# EAGLE design RATT_REV1 (EAGLE 7.7.0)
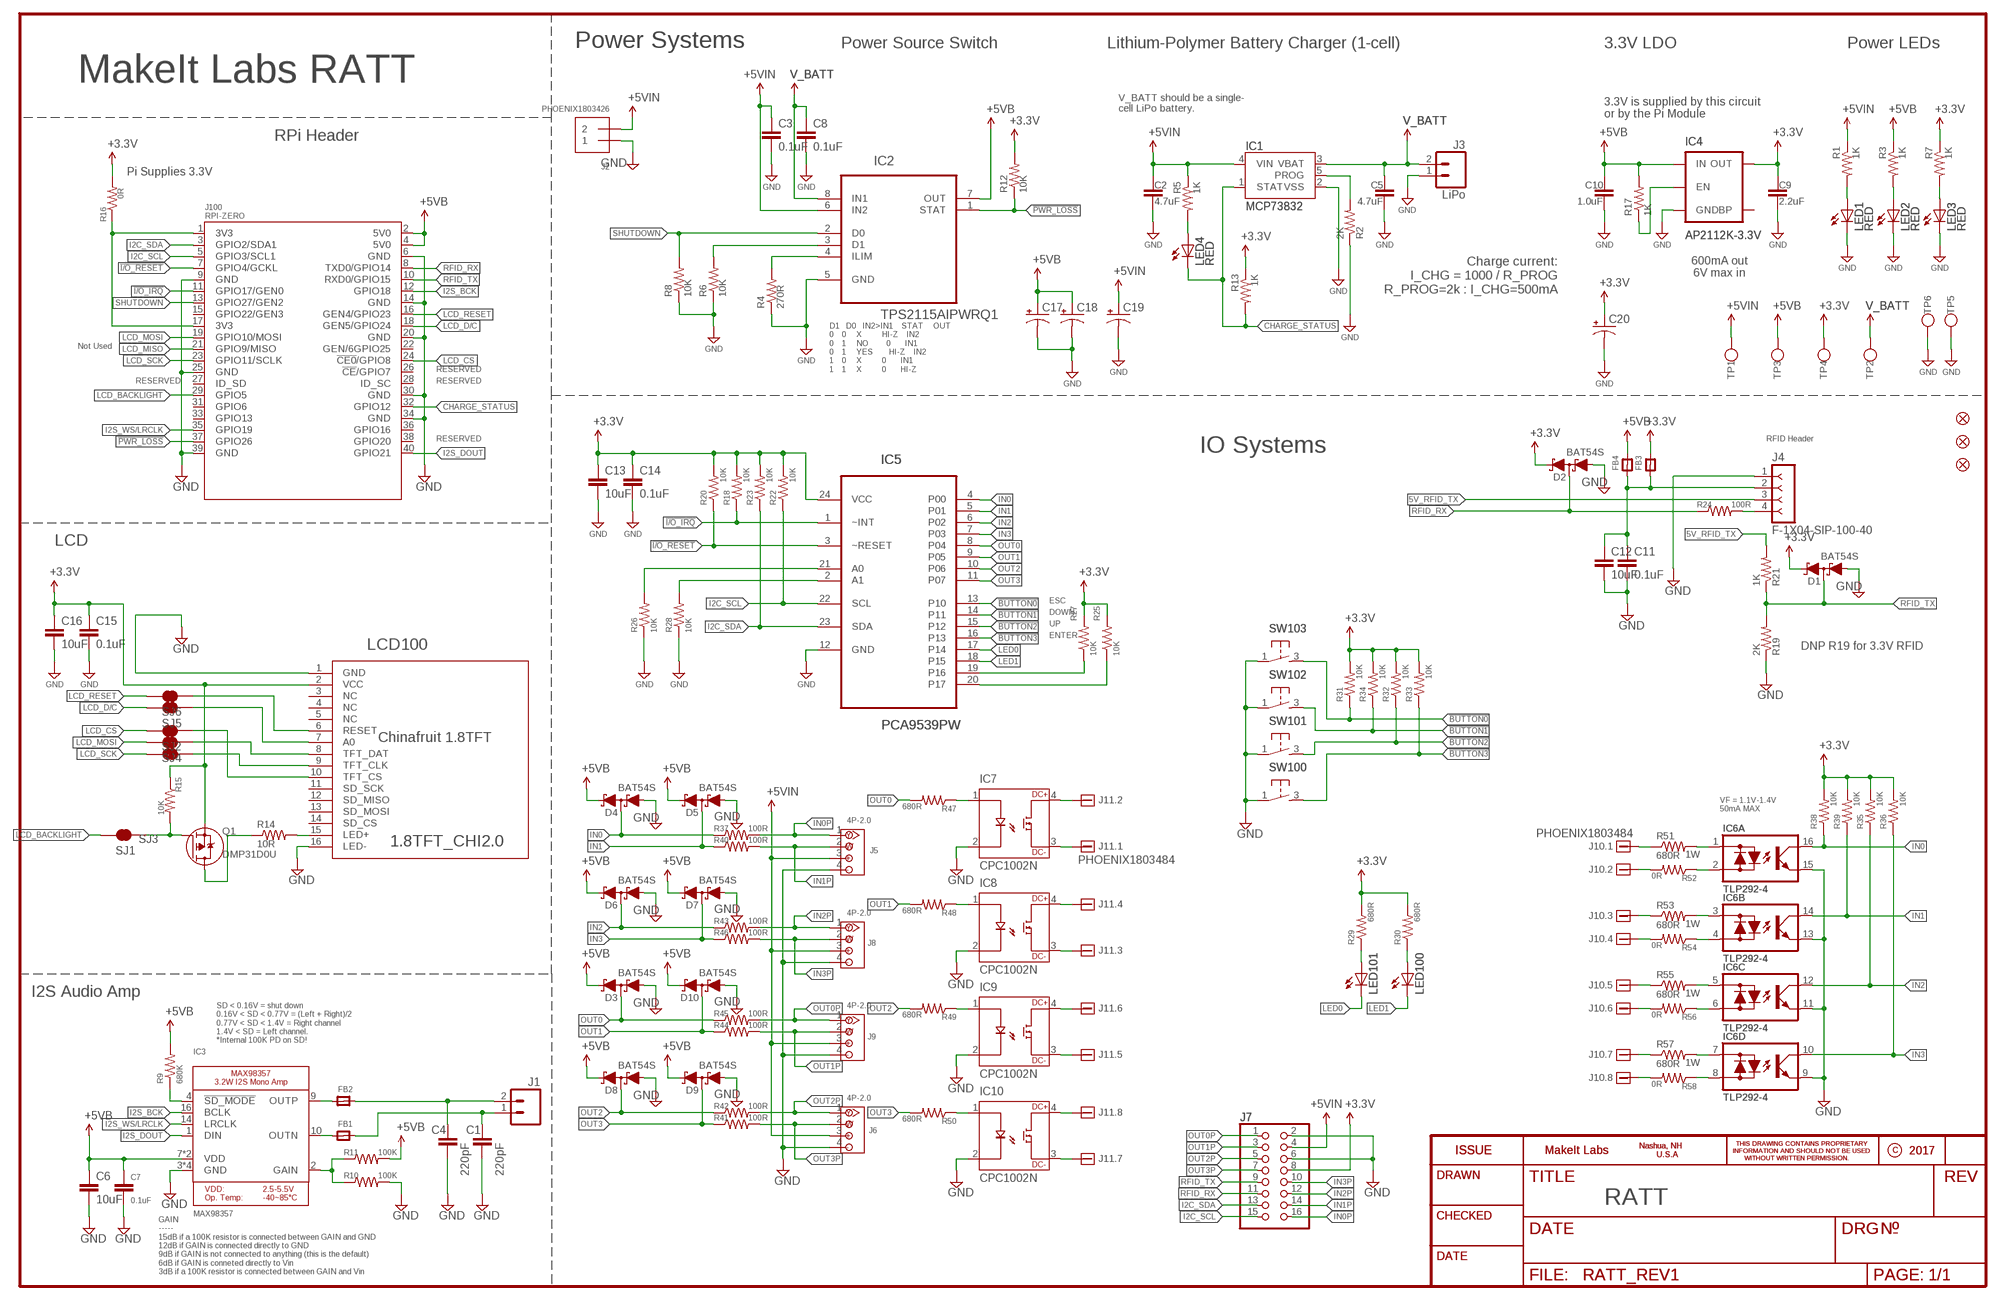
[diagram p0: schematic, sheet 1]

## Parts
C1  220pF  CAP0603  [0603-CAP]
C2  4.7uF  CAP0603  [0603-CAP]
C3  0.1uF  CAP0603  [0603-CAP]
C4  220pF  CAP0603  [0603-CAP]
C5  4.7uF  CAP0603  [0603-CAP]
C6  10uF  CAP0805  [0805-CAP]
C7  0.1uF  CAP0603  [0603-CAP]
C8  0.1uF  CAP0603  [0603-CAP]
C9  2.2uF  CAP0603  [0603-CAP]
C10  1.0uF  CAP0603  [0603-CAP]
C11  0.1uF  CAP0603  [0603-CAP]
C12  10uF  CAP0805  [0805-CAP]
C13  10uF  CAP0805  [0805-CAP]
C14  0.1uF  CAP0603  [0603-CAP]
C15  0.1uF  CAP0603  [0603-CAP]
C16  10uF  CAP0805  [0805-CAP]
C17  CPOL-USD  [PANASONIC_D]
C18  CPOL-USD  [PANASONIC_D]
C19  CPOL-USD  [PANASONIC_D]
C20  CPOL-USD  [PANASONIC_D]
D1  BAT54S  [SOT-23]
D2  BAT54S  [SOT-23]
D3  BAT54S  [SOT-23]
D4  BAT54S  [SOT-23]
D5  BAT54S  [SOT-23]
D6  BAT54S  [SOT-23]
D7  BAT54S  [SOT-23]
D8  BAT54S  [SOT-23]
D9  BAT54S  [SOT-23]
D10  BAT54S  [SOT-23]
FB1  FERRITE  [0603]
FB2  FERRITE  [0603]
FB3  FERRITE  [0603]
FB4  FERRITE  [0603]
FID1  FIDUCIAL40MILX80MIL  [FIDUCIAL-40MILX80MIL]
FID2  FIDUCIAL40MILX80MIL  [FIDUCIAL-40MILX80MIL]
FID3  FIDUCIAL40MILX80MIL  [FIDUCIAL-40MILX80MIL]
IC1  MCP73832  MCP73831  [SOT23-5]
IC2  TPS2115AIPWRQ1  [SOP65P640X120-8N]
IC3  MAX98357  AUDIOAMP_MAX98357  [QFN16_3MM]
IC4  AP2112K-3.3V  V_REG_LDOSMD  [SOT23-5]
IC5  PCA9539PW  [SOP65P640X120-24N]
IC6  TLP292-4  [SO-16]
IC7  CPC1002N  [CPC1002N]
IC8  CPC1002N  [CPC1002N]
IC9  CPC1002N  [CPC1002N]
IC10  CPC1002N  [CPC1002N]
J1  M02POLAR  [MOLEX-1X2]
J2  PHOENIX1803426  [1803426]
J3  LiPo  M02JST-PTH-2  [JST-2-PTH]
J4  F-1X04-SIP-100-40  [SIP-100-04-40]
J5  4P-2.0  GROVE-CONNECTOR-TH-VERT  [HW4-2.0]
J6  4P-2.0  GROVE-CONNECTOR-TH-VERT  [HW4-2.0]
J7  PINHD-2X8SHROUD  [2X08_SHROUD]
J8  4P-2.0  GROVE-CONNECTOR-TH-VERT  [HW4-2.0]
J9  4P-2.0  GROVE-CONNECTOR-TH-VERT  [HW4-2.0]
J10  PHOENIX1803484  [1803484]
J11  PHOENIX1803484  [1803484]
J100  RPI-ZERO  [RASPBERRYPI_BASTELSTUBE_V13_RASPI_BOARD_B+_FULL]
LCD100  1.8TFT_CHI2.0  [1.8TFT_CHI_2.0]
LED1  RED  LED-RED0603  [LED-0603]
LED2  RED  LED-RED0603  [LED-0603]
LED3  RED  LED-RED0603  [LED-0603]
LED4  RED  LED-RED0603  [LED-0603]
LED100  LED5MM  [LED5MM]
LED101  LED5MM  [LED5MM]
Q1  DMP31D0U  [SOT23]
R1  1K  RESISTOR0603  [0603-RES]
R2  2K  RESISTOR0603  [0603-RES]
R3  1K  RESISTOR0603  [0603-RES]
R4  270R  RESISTOR0603  [0603-RES]
R5  1K  RESISTOR0603  [0603-RES]
R6  10K  RESISTOR0603  [0603-RES]
R7  1K  RESISTOR0603  [0603-RES]
R8  10K  RESISTOR0603  [0603-RES]
R9  680K  RESISTOR0603  [0603-RES]
R10  100K  RESISTOR0603  [0603-RES]
R11  100K  RESISTOR0603  [0603-RES]
R12  10K  RESISTOR0603  [0603-RES]
R13  1K  RESISTOR0603  [0603-RES]
R14  10R  RESISTOR1206  [1206-RES]
R15  10K  RESISTOR0603  [0603-RES]
R16  0R  RESISTOR0603  [0603-RES]
R17  1K  RESISTOR0603  [0603-RES]
R18  10K  RESISTOR0603  [0603-RES]
R19  2K  RESISTOR0603  [0603-RES]
R20  10K  RESISTOR0603  [0603-RES]
R21  1K  RESISTOR0603  [0603-RES]
R22  10K  RESISTOR0603  [0603-RES]
R23  10K  RESISTOR0603  [0603-RES]
R24  100R  RESISTOR0603  [0603-RES]
R25  10K  RESISTOR0603  [0603-RES]
R26  10K  RESISTOR0603  [0603-RES]
R27  10K  RESISTOR0603  [0603-RES]
R28  10K  RESISTOR0603  [0603-RES]
R29  680R  RESISTOR0603  [0603-RES]
R30  680R  RESISTOR0603  [0603-RES]
R31  10K  RESISTOR0603  [0603-RES]
R32  10K  RESISTOR0603  [0603-RES]
R33  10K  RESISTOR0603  [0603-RES]
R34  10K  RESISTOR0603  [0603-RES]
R35  10K  RESISTOR0603  [0603-RES]
R36  10K  RESISTOR0603  [0603-RES]
R37  100R  RESISTOR0603  [0603-RES]
R38  10K  RESISTOR0603  [0603-RES]
R39  10K  RESISTOR0603  [0603-RES]
R40  100R  RESISTOR0603  [0603-RES]
R41  100R  RESISTOR0603  [0603-RES]
R42  100R  RESISTOR0603  [0603-RES]
R43  100R  RESISTOR0603  [0603-RES]
R44  100R  RESISTOR0603  [0603-RES]
R45  100R  RESISTOR0603  [0603-RES]
R46  100R  RESISTOR0603  [0603-RES]
R47  680R  RESISTOR0603  [0603-RES]
R48  680R  RESISTOR0603  [0603-RES]
R49  680R  RESISTOR0603  [0603-RES]
R50  680R  RESISTOR0603  [0603-RES]
R51  680R  RESISTOR2512  [2512-RES]
R52  0R  RESISTOR0603  [0603-RES]
R53  680R  RESISTOR2512  [2512-RES]
R54  0R  RESISTOR0603  [0603-RES]
R55  680R  RESISTOR2512  [2512-RES]
R56  0R  RESISTOR0603  [0603-RES]
R57  680R  RESISTOR2512  [2512-RES]
R58  0R  RESISTOR0603  [0603-RES]
SJ1  JUMPER-PAD-2-NC_BY_TRACE  SOLDERJUMPER_CLOSED10MIL  [SOLDERJUMPER_10MIL]
SJ2  JUMPER-PAD-2-NC_BY_TRACE  SOLDERJUMPER_CLOSED10MIL  [SOLDERJUMPER_10MIL]
SJ3  JUMPER-PAD-2-NC_BY_TRACE  SOLDERJUMPER_CLOSED10MIL  [SOLDERJUMPER_10MIL]
SJ4  JUMPER-PAD-2-NC_BY_TRACE  SOLDERJUMPER_CLOSED10MIL  [SOLDERJUMPER_10MIL]
SJ5  JUMPER-PAD-2-NC_BY_TRACE  SOLDERJUMPER_CLOSED10MIL  [SOLDERJUMPER_10MIL]
SJ6  JUMPER-PAD-2-NC_BY_TRACE  SOLDERJUMPER_CLOSED10MIL  [SOLDERJUMPER_10MIL]
SW100  ESWITCH_320  [ESWITCH320]
SW101  ESWITCH_320  [ESWITCH320]
SW102  ESWITCH_320  [ESWITCH320]
SW103  ESWITCH_320  [ESWITCH320]
TP1  5VIN  RCW-0C  [1206-RCW]
TP2  BATT  RCW-0C  [1206-RCW]
TP3  5VB  RCW-0C  [1206-RCW]
TP4  3.3V  RCW-0C  [1206-RCW]
TP5  GND  RCW-0C  [1206-RCW]
TP6  GND  RCW-0C  [1206-RCW]

## Nets
3V3: J100.1(3V3) J100.17(3V3) R16.1
5V_RFID_TX: J4.3 R21.2
!BUTTON0: IC5.13(P10) R31.1 SW103.3
!BUTTON1: IC5.14(P11) R34.1 SW102.3
!BUTTON2: IC5.15(P12) R32.1 SW101.3
!BUTTON3: IC5.16(P13) R33.1 SW100.3
!I/O_IRQ: IC5.1(~INT) J100.11(GPIO17/GEN0) R18.1
!I/O_RESET: IC5.3(~RESET) J100.7(GPIO4/GCKL) R20.1
!PWR_LOSS: IC2.1(STAT) J100.37(GPIO26) R12.1
+3.3V: C9.1 C13.1 C14.1 C15.1 C16.1 C20.+ D1.2(C2) D2.2(C2) FB3.2 IC4.5(OUT) IC5.24(VCC) J7.8 LCD100.2(VCC) Q1.2(S) R7.1 R12.2 R13.1 R15.1 R16.2 R18.2 R20.2 R22.2 R23.2 R25.2 R27.2 R29.2 R30.2 R31.2 R32.2 R33.2 R34.2 R35.2 R36.2 R38.2 R39.2 TP4.1(TP)
+5VB: C6.1 C7.1 C10.1 C17.+ C18.+ D3.2(C2) D4.2(C2) D5.2(C2) D6.2(C2) D7.2(C2) D8.2(C2) D9.2(C2) D10.2(C2) FB4.2 IC2.7(OUT) IC3.7(VDD) IC3.8(VDD) IC4.1(IN) J100.2(5V0) J100.4(5V0) R3.1 R9.2 R11.2 R17.2 TP3.1(TP)
+5VIN: C2.1 C3.1 C19.+ IC1.4(VIN) IC2.6(IN2) J2.2 J5.3 J6.3 J7.4 J8.3 J9.3 R1.1 R5.1 TP1.1(TP)
CHARGE_STATUS: IC1.1(STAT) J100.32(GPIO12) LED4.C R13.2
GND: C1.2 C2.2 C3.2 C4.2 C5.2 C6.2 C7.2 C8.2 C9.2 C10.2 C11.2 C12.2 C13.2 C14.2 C15.2 C16.2 C17.- C18.- C19.- C20.- D1.1(A1) D2.1(A1) D3.1(A1) D4.1(A1) D5.1(A1) D6.1(A1) D7.1(A1) D8.1(A1) D9.1(A1) D10.1(A1) IC1.2(VSS) IC2.5(GND) IC3.3(GND) IC3.11(GND) IC3.15(GND) IC3.THERMAL(GND) IC4.2(GND) IC5.12(GND) IC6.9(D:E) IC6.11(C:E) IC6.13(B:E) IC6.15(A:E) IC7.2(CATHODE) IC8.2(CATHODE) IC9.2(CATHODE) IC10.2(CATHODE) J2.1 J3.1 J4.1 J5.4 J6.4 J7.2 J7.6 J8.4 J9.4 J100.6(GND) J100.9(GND) J100.14(GND) J100.20(GND) J100.25(GND) J100.30(GND) J100.34(GND) J100.39(GND) LCD100.1(GND) LCD100.16(LED-) LED1.C LED2.C LED3.C R2.1 R4.1 R6.1 R8.1 R10.2 R19.1 R26.1 R28.1 SW100.1 SW101.1 SW102.1 SW103.1 TP5.1(TP) TP6.1(TP)
I2C_SCL: IC5.22(SCL) J7.15 J100.5(GPIO3/SCL1) R22.1
I2C_SDA: IC5.23(SDA) J7.13 J100.3(GPIO2/SDA1) R23.1
I2S_BCK: IC3.16(BCLK) J100.12(GPIO18)
I2S_DOUT: IC3.1(DIN) J100.40(GPIO21)
I2S_WS/LRCLK: IC3.14(LRCLK) J100.35(GPIO19)
IN0: D4.3(C1A2) IC5.4(P00) IC6.16(A:C) R37.1 R38.1
IN0P: J5.1 J7.16 R37.2
IN1: D5.3(C1A2) IC5.5(P01) IC6.14(B:C) R39.1 R40.1
IN1P: J5.2 J7.14 R40.2
IN2: D6.3(C1A2) IC5.6(P02) IC6.12(C:C) R35.1 R43.1
IN2P: J7.12 J8.1 R43.2
IN3: D7.3(C1A2) IC5.7(P03) IC6.10(D:C) R36.1 R46.1
IN3P: J7.10 J8.2 R46.2
LCD_BACKLIGHT: J100.29(GPIO5) SJ1.2
LCD_CS: J100.24(!CE0!/GPIO8) SJ2.2
LCD_D/C: J100.18(GEN5/GPIO24) SJ5.2
LCD_MISO: J100.21(GPIO9/MISO)
LCD_MOSI: J100.19(GPIO10/MOSI) SJ4.2
LCD_RESET: J100.16(GEN4/GPIO23) SJ6.2
LCD_SCK: J100.23(GPIO11/SCLK) SJ3.2
LED0: IC5.17(P14) LED101.K(C)
LED1: IC5.18(P15) LED100.K(C)
N$1: IC3.2(GAIN) R10.1 R11.1
N$2: FB2.1 IC3.9(OUTP)
N$3: Q1.3(D) R14.1
N$4: FB1.1 IC3.10(OUTN)
N$5: IC3.4(!SD_MODE) R9.1
N$6: C1.1 FB1.2 J1.1
N$7: C4.1 FB2.2 J1.2
N$8: IC5.20(P17) R25.1
N$9: LCD100.15(LED+) R14.2
N$10: J4.4 R24.2
N$11: LED3.A R7.2
N$12: LED2.A R3.2
N$13: IC5.19(P16) R27.1
N$14: IC1.5(PROG) R2.2
N$15: IC6.2(A:AC2) R52.1
N$17: LED4.A R5.2
N$18: IC4.3(EN) R17.1
N$19: IC6.1(A:AC1) R51.2
N$20: IC6.8(D:AC2) R58.1
N$21: IC5.21(A0) R26.2
N$22: IC5.2(A1) R28.2
N$23: IC6.7(D:AC1) R57.2
N$24: IC6.6(C:AC2) R56.1
N$25: IC6.5(C:AC1) R55.2
N$26: IC2.3(D1) R6.2
N$27: LCD100.6(RESET) SJ6.1
N$28: LCD100.7(A0) SJ5.1
N$29: LCD100.10(TFT_CS) SJ2.1
N$30: LCD100.8(TFT_DAT) SJ4.1
N$31: LCD100.9(TFT_CLK) SJ3.1
N$32: IC7.3(DC-) J11.1
N$33: Q1.1(G) R15.2 SJ1.1
N$36: IC6.4(B:AC2) R54.1
N$37: IC2.4(ILIM) R4.2
N$39: IC6.3(B:AC1) R53.2
N$40: J10.4 R54.2
N$41: J10.3 R53.1
N$42: J10.2 R52.2
N$43: J10.1 R51.1
N$44: J10.5 R55.1
N$45: J10.6 R56.2
N$46: J10.7 R57.1
N$47: J10.8 R58.2
N$48: LED101.A R29.1
N$49: LED100.A R30.1
N$50: LED1.A R1.2
N$51: C11.1 C12.1 FB3.1 FB4.1 J4.2
N$58: IC7.1(ANODE) R47.1
N$59: IC7.4(DC+) J11.2
N$60: IC10.3(DC-) J11.7
N$61: IC8.1(ANODE) R48.1
N$62: IC10.4(DC+) J11.8
N$63: IC9.3(DC-) J11.5
N$64: IC9.4(DC+) J11.6
N$65: IC8.3(DC-) J11.3
N$66: IC8.4(DC+) J11.4
N$68: IC9.1(ANODE) R49.1
N$69: IC10.1(ANODE) R50.1
OUT0: D3.3(C1A2) IC5.8(P04) R45.1 R47.2
OUT0P: J7.1 J9.1 R45.2
OUT1: D10.3(C1A2) IC5.9(P05) R44.1 R48.2
OUT1P: J7.3 J9.2 R44.2
OUT2: D8.3(C1A2) IC5.10(P06) R42.1 R49.2
OUT2P: J6.1 J7.5 R42.2
OUT3: D9.3(C1A2) IC5.11(P07) R41.1 R50.2
OUT3P: J6.2 J7.7 R41.2
RFID_RX: D2.3(C1A2) J7.11 J100.8(TXD0/GPIO14) R24.1
RFID_TX: D1.3(C1A2) J7.9 J100.10(RXD0/GPIO15) R19.2 R21.1
SHUTDOWN: IC2.2(D0) J100.13(GPIO27/GEN2) R8.2
V_BATT: C5.1 C8.1 IC1.3(VBAT) IC2.8(IN1) J3.2 TP2.1(TP)
Unconnected: IC4.4(BP) J100.15(GPIO22/GEN3) J100.22(GEN/6GPIO25) J100.26(!CE!/GPIO7) J100.27(ID_SD) J100.28(ID_SC) J100.31(GPIO6) J100.33(GPIO13) J100.36(GPIO16) J100.38(GPIO20) LCD100.3(NC) LCD100.4(NC) LCD100.5(NC) LCD100.11(SD_SCK) LCD100.12(SD_MISO) LCD100.13(SD_MOSI) LCD100.14(SD_CS)

## Notes on the sheet
- Power Systems | Power Source Switch | Lithium-Polymer Battery Charger (1-cell) | 3.3V LDO | Power LEDs
- MakeIt Labs RATT
- V_BATT should be a single-
  cell LiPo battery.
- 3.3V is supplied by this circuit
  or by the Pi Module
- RPi Header
- Pi Supplies 3.3V
- Charge current:
  I_CHG = 1000 / R_PROG
  R_PROG=2k : I_CHG=500mA
- 600mA out
  6V max in
- Not Used
- RESERVED
- D1   D0   IN2>IN1    STAT     OUT
  0    0     X          HI-Z    IN2
  0    1     NO         0       IN1
  0    1     YES        HI-Z    IN2
  1    0     X          0       IN1
  1    1     X          0       HI-Z
- RESERVED | RESERVED
- RESERVED | RFID Header
- IO Systems
- LCD
- ESC
- DOWN
- UP
- ENTER
- DNP R19 for 3.3V RFID
- VF = 1.1V-1.4V
  50mA MAX
- I2S Audio Amp
- SD < 0.16V = shut down 
  0.16V < SD < 0.77V = (Left + Right)/2 
  0.77V < SD < 1.4V = Right channel
  1.4V < SD = Left channel.
  *Internal 100K PD on SD!
- RATT
- GAIN
  -----
  15dB if a 100K resistor is connected between GAIN and GND 
  12dB if GAIN is connected directly to GND 
  9dB if GAIN is not connected to anything (this is the default)
  6dB if GAIN is conneted directly to Vin 
  3dB if a 100K resistor is connected between GAIN and Vin

## Library data of the parts
C1-C6 C8-C16 = MakeItLabs:CAP: Capacitor Standard ceramic capacitor Footprints per IPC-7351 Density Level B
C7 = MakeItLabs:CAP: Capacitor Standard ceramic capacitor Footprints per IPC-7351 Density Level B; RATING: X7R; TOL: 10%; V: 16V
C17-C20 = MakeItLabs:CPOL-US: POLARIZED CAPACITOR, American symbol
D1-D10 = MakeItLabs:BAT54S: Schottky Diodes Dual Diodes, Cathode to Anode
FB1-FB4 = MakeItLabs:FERRITE: Ferrite Bead 0603 MMZ1608B121C - 120 Ohm @ 100MHz, 600mA, 0.15 Ohm DC Resistance - Digikey: 445-2164-1-ND BK1608HW121-T - 120 Ohm, 600mA Ferrite Chip - Digikey: 587-1876-2-ND 0805 HZ0805B272R-10 - 2.7K Ohm @ 100MHz, 200mA, 0.8 Ohm DC Resistance - Digikey: 240-2504-1-ND (see also Murata BLM21BD272SN1L) MMZ2012Y152B - 1.5K Ohm @ 100MHz, 500mA, 0.4 Ohm DC Resistance - Digikey: 445-1560-1-ND - Mainly for high frequency (80-400MHz) MMZ2012R102A - 1K Ohm @ 100MHz, 500mA, 0.3 Ohm DC Resistance - Digikey: 445-1555-2-ND - More general purpose (10-200MHz)
FID1-FID3 = MakeItLabs:FIDUCIAL: Fiducial Alignment Points Various fiducial points for machine vision alignment.
IC1 = MakeItLabs:MCP73831: Miniature single cell, fully integrated Li-Ion, Li-polymer charge management controller http://ww1.microchip.com/downloads/en/DeviceDoc/20001984g.pdf IC-09995; PROD_ID: IC-09995
IC2 = MakeItLabs:TPS2115AIPWRQ1: AUTO-SWITCHING POWER MULTIPLEXER; MPN: TPS2115AIPWRQ1; OC_FARNELL: -; OC_NEWARK: 52P6807; PACKAGE: TSSOP-8; SUPPLIER: Texas Instruments
IC3 = MakeItLabs:AUDIOAMP_MAX98357: MAX98357 - 3.2W I2S Mono Audio Amp
IC4 = MakeItLabs:V_REG_LDO: Voltage Regulator LDO Standard 150mA LDO voltage regulator in SOT-23 layout. Micrel part MIC5205. BP (by-pass) pin is used to lower output noise with 470pF cap.; PROD_ID: VREG-12457
IC5 = MakeItLabs:PCA9539PW: REMOTE 16-BIT I2C AND SMBus LOW-POWER I/O EXPANDER WITH INTERRUPT OUTPUT, RESET, AND CONFIGURATION REGISTERS; MPN: PCA9539PW; OC_FARNELL: 1470505; OC_NEWARK: 63K6061; PACKAGE: TSSOP-24; SUPPLIER: Texas Instruments
IC6 = MakeItLabs:TLP292-4: Optoisolator Transistor Output 3750Vrms 4 Channel 16-SO
IC7-IC10 = MakeItLabs:CPC1002N
J1 J3 = MakeItLabs:M02: Header 2 Standard 2-pin 0.1" header. Use with straight break away headers (SKU : PRT-00116), right angle break away headers (PRT-00553), swiss pins (PRT-00743), machine pins (PRT-00117), and female headers (PRT-00115). Molex polarized connector foot print use with SKU : PRT-08233 with associated crimp pins and housings.
J2 = MakeItLabs:PHOENIX1803426
J4 = MakeItLabs:F-1X04-: FEMALE HEADER
J5 J6 J8 J9 = MakeItLabs:GROVE-CONNECTOR-TH: 320110033
J7 = MakeItLabs:PINHD-2X8: PIN HEADER
J10 J11 = MakeItLabs:PHOENIX1803484: 8 A 60 V Pitch: 3.81 mm Position: 8 Source: https://www.phoenixcontact.com/us/products/1803484
J100 = MakeItLabs:RPI-ZERO
LCD100 = MakeItLabs:1.8TFT_CHI
LED1-LED4 = MakeItLabs:LED-RED: Assorted Red LEDs LilyPad 1206- DIO-09912 1206- DIO-00809 0603- DIO-00819; PROD_ID: DIO-09912
LED100 LED101 = MakeItLabs:LED: LEDs Standard schematic elements and footprints for 5mm, 3mm, 1206, and 0603 sized LEDs. 5mm - Spark Fun Electronics SKU : COM-00529 (and others)
Q1 = MakeItLabs:DMP31D0U
R1-R50 R52 R54 R56 R58 = MakeItLabs:RESISTOR: Resistor Basic schematic elements and footprints for 0603, 1206, and PTH resistors.
R51 R53 R55 R57 = MakeItLabs:RESISTOR: Resistor Basic schematic elements and footprints for 0603, 1206, and PTH resistors.; P: 1W
SJ1-SJ6 = MakeItLabs:SOLDERJUMPER_CLOSED: Solder Jumper - Closed These solder jumpers are closed by default CLOSEDWIRE - 10 mil trace between pads that can be cut and resoldered later CLOSEDPERM - 63 mil trace between pads for a permanent connection (used to 'bridge' two signals, a shameless hack for Eagle). Can double as a test point as well (no cream layer)
SW100-SW103 = MakeItLabs:ESWITCH_320
TP1-TP6 = MakeItLabs:RCW-0C: SMD Circuit Probe Pad Test Pad 1206 Size

## Board
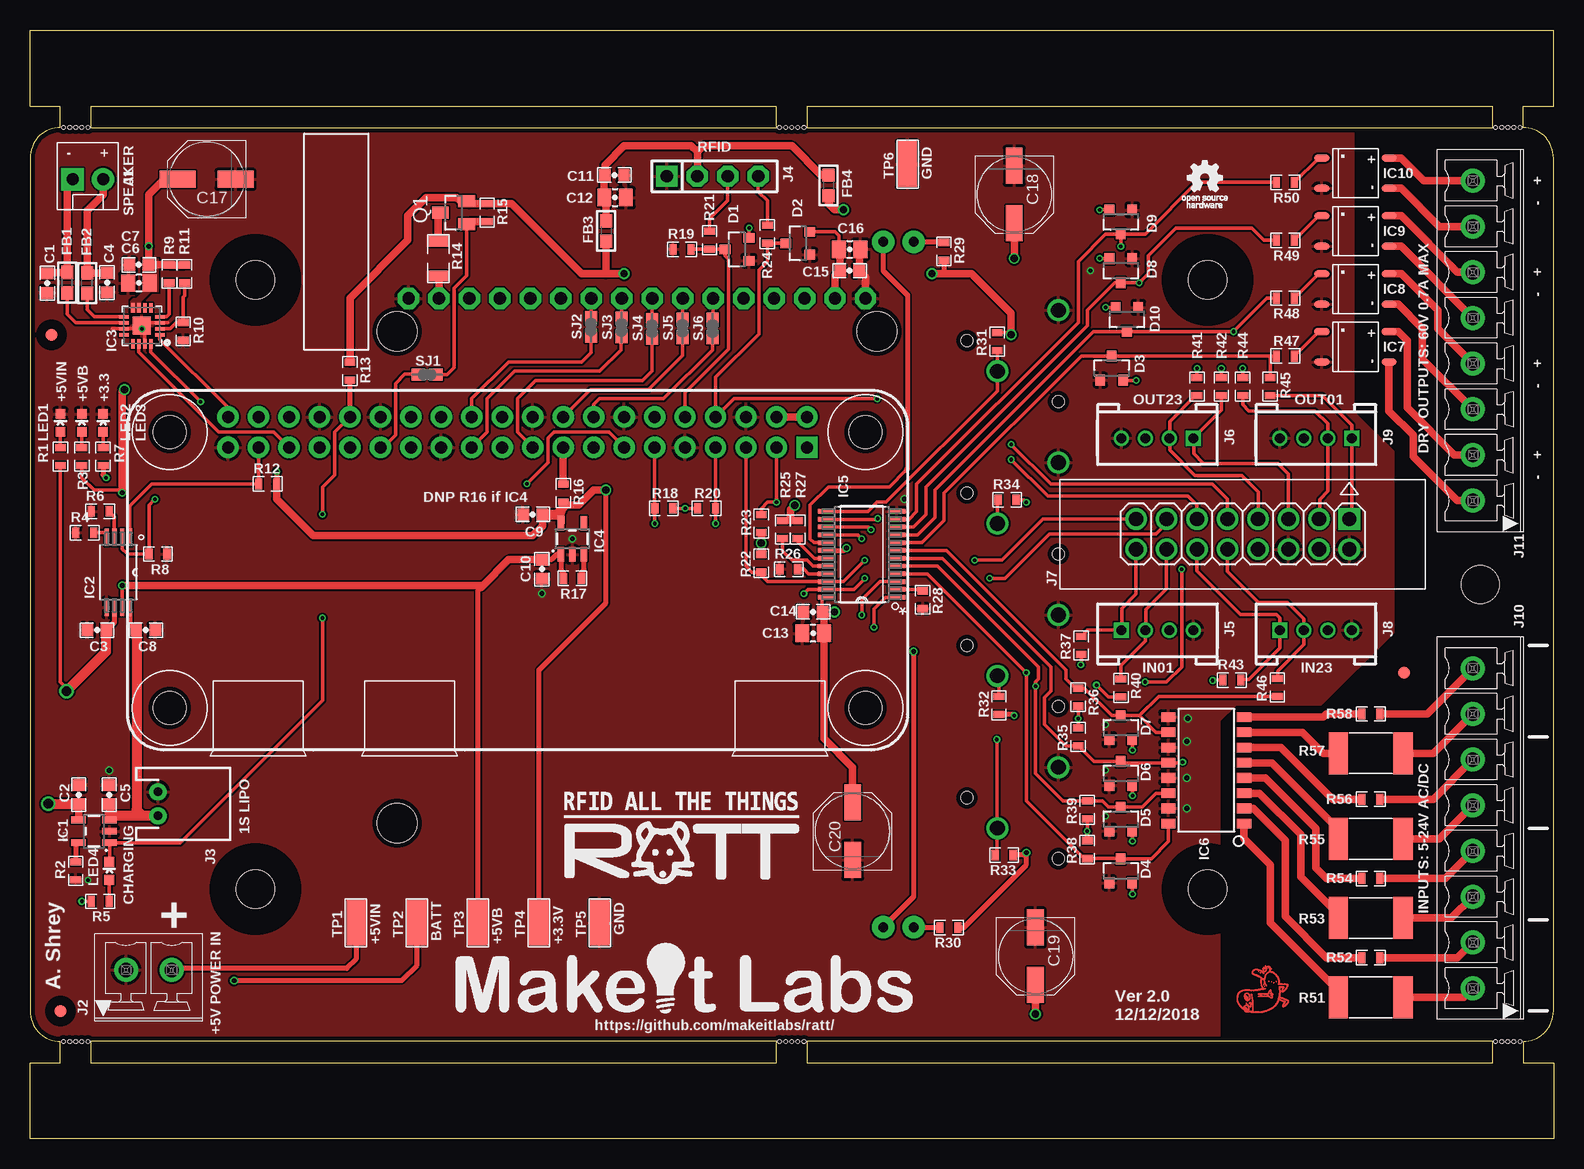
[diagram p1: board, top side]
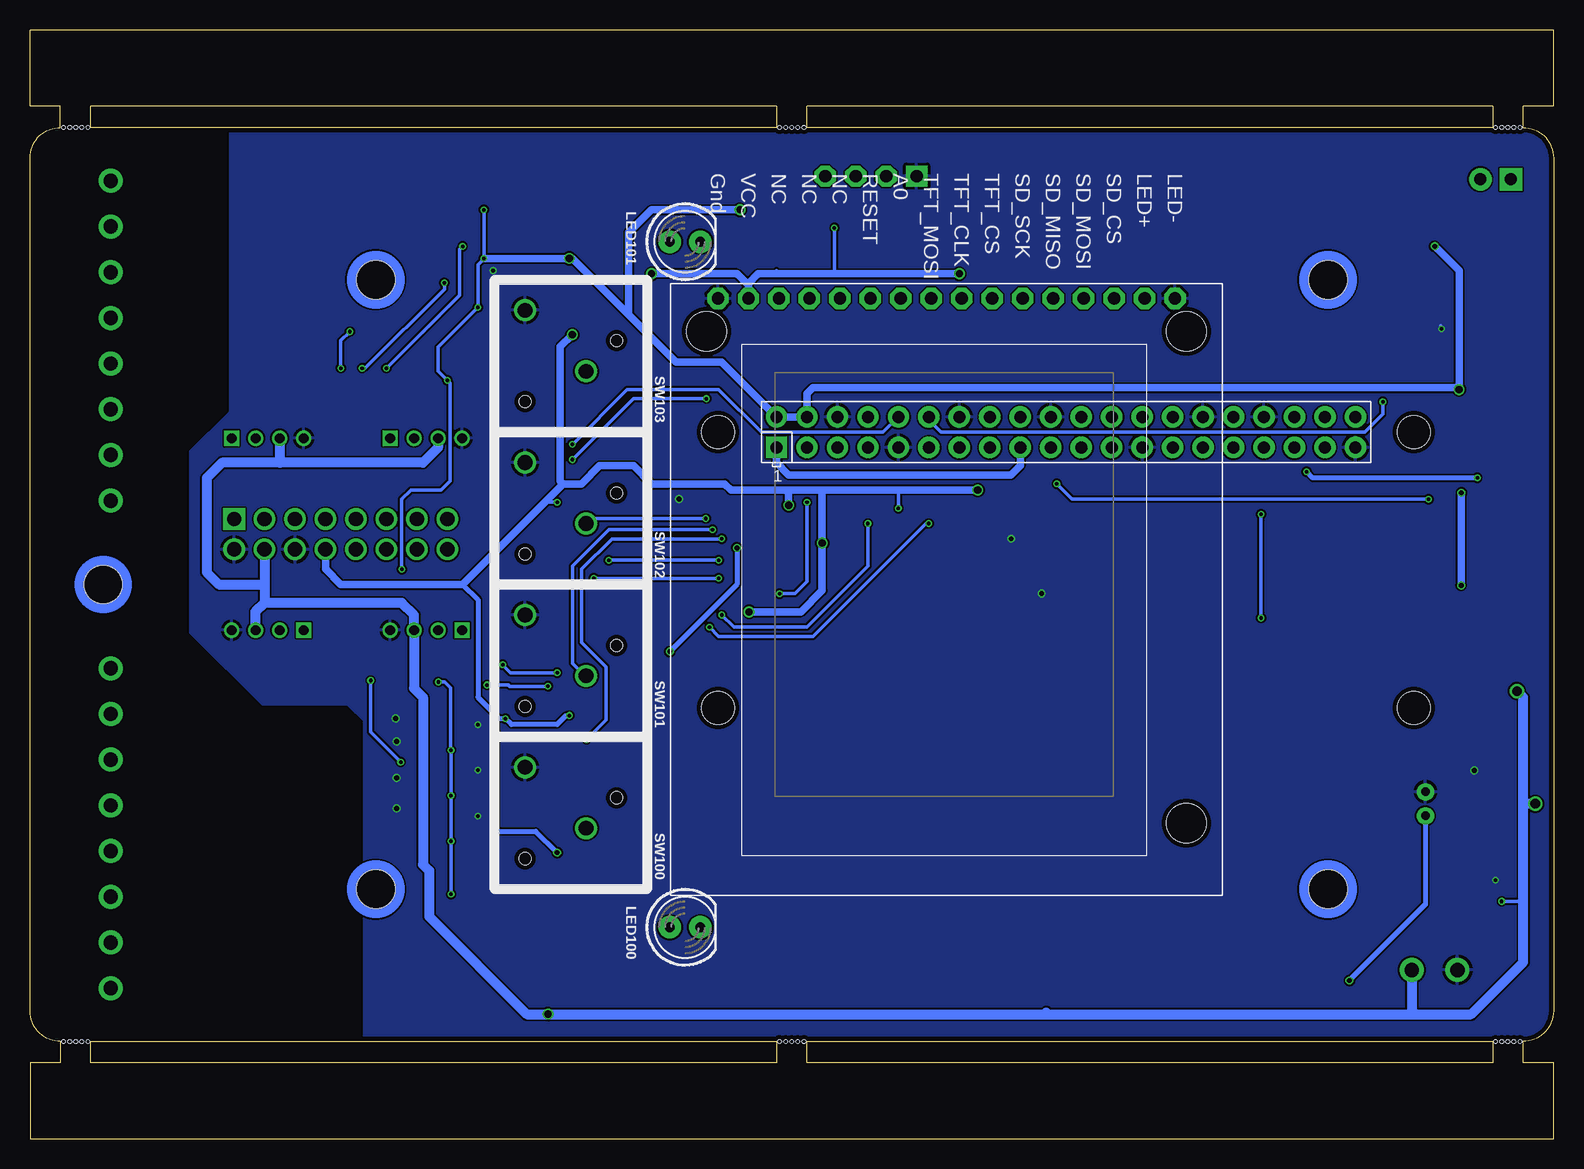
[diagram p2: board, bottom side, seen from below]

Size 127 x 92.46 mm. Coordinates in mm from the lower left corner, seen from the top.
Outline: 0,10.67 arc90 2.54,8.13 2.54,6.35 0,6.35 0,0 127,0 127,6.35 124.46,6.35 124.46,8.13 arc90 127,10.67 127,81.79 arc90 124.46,84.33 124.46,86.11 127,86.11 127,92.46 0,92.46 0,86.11 2.54,86.11 2.54,84.33 arc90 0,81.79 0,10.67
Outline: 62.23,6.35 62.23,8.13 5.08,8.13 5.08,6.35 62.23,6.35
Outline: 64.77,8.13 64.77,6.35 121.92,6.35 121.92,8.13 64.77,8.13
Outline: 5.08,86.11 5.08,84.33 62.23,84.33 62.23,86.11 5.08,86.11
Outline: 121.92,84.33 121.92,86.11 64.77,86.11 64.77,84.33 121.92,84.33
Copper layers (1*16): Top 0.035559375mm / dielectric 1.6mm / Bottom 0.035559375mm
Design rules "oshpark-2layer": minimum track width 6mil, minimum drill 10mil, track to track 6mil, track to pad 6mil, pad to pad 6mil, via to via 6mil, smd to smd 6mil, copper to edge 15mil, drill to drill 6mil, minimum pad ring 5mil, minimum via ring 5mil, stop-mask expansion 2.5mil, vias tented up to drill 0mil, thermal gap 10mil
Holes 3.17 mm at 18.8,71.63 18.8,20.83 98.17,71.63 98.17,20.83 120.9,46.23
Holes 0.3 mm at 62.48,8.13 62.99,8.13 63.5,8.13 64.01,8.13 64.52,8.13 2.79,8.13 3.3,8.13 3.81,8.13 4.32,8.13 4.83,8.13 122.17,8.13 122.68,8.13 123.19,8.13 123.7,8.13 124.21,8.13 2.79,84.33 3.3,84.33 3.81,84.33 4.32,84.33 4.83,84.33 122.17,84.33 122.68,84.33 123.19,84.33 123.7,84.33 124.21,84.33 62.48,84.33 62.99,84.33 63.5,84.33 64.01,84.33 64.52,84.33
tKeepout: area 15,67.8 to 22.6,75.4; area 15,17 to 22.6,24.6; area 94.4,17 to 102,24.6; area 94.4,67.8 to 102,75.4; area 117.1,42.4 to 124.7,50
tRestrict: area 117.1,42.4 to 124.7,50; area 94.4,17 to 102,24.6; area 94.4,67.8 to 102,75.4; area 15,67.8 to 22.6,75.4; area 15,17 to 22.6,24.6

### Footprints (pad centres in the part's own frame; a part is rotated, then mirrored left to right if it is on the bottom)
0603-CAP = smd 0.95 x 1: 1 -0.8,0; 2 0.8,0
0805-CAP = smd 1.15 x 1.45: 1 -0.9,0; 2 0.9,0
PANASONIC_D = smd 3 x 1.4: + 2.4,0; - -2.4,0
SOT-23 = smd 0.8 x 0.9: 1 -0.95,-1; 2 0.95,-1; 3 0,1
0603 = smd 1.1 x 1: 1 -0.85,0; 2 0.85,0
FIDUCIAL-40MILX80MIL = smd 1.016 x 1.016: 1 0,0
SOT23-5 = smd 0.55 x 1.2: 1 -0.95,-1.3; 2 0,-1.3; 3 0.95,-1.3; 4 0.95,1.3; 5 -0.95,1.3
SOP65P640X120-8N = smd 1.473 x 0.356: 1 -2.921,0.965; 2 -2.921,0.33; 3 -2.921,-0.33; 4 -2.921,-0.965; 5 2.921,-0.965; 6 2.921,-0.33; 7 2.921,0.33; 8 2.921,0.965
QFN16_3MM = smd 0.8 x 0.28: 1 -1.5,0.75; 2 -1.5,0.25; 3 -1.5,-0.25; 4 -1.5,-0.75; 9 1.5,-0.75; 10 1.5,-0.25; 11 1.5,0.25; 12 1.5,0.75 | smd 0.28 x 0.8: 5 -0.75,-1.5; 6 -0.25,-1.5; 7 0.25,-1.5; 8 0.75,-1.5; 13 0.75,1.5; 14 0.25,1.5; 15 -0.25,1.5; 16 -0.75,1.5 | smd 1.5 x 1.5: THERMAL 0,0
SOP65P640X120-24N = smd 1.473 x 0.356: 1 -2.921,3.581; 2 -2.921,2.921; 3 -2.921,2.286; 4 -2.921,1.626; 5 -2.921,0.965; 6 -2.921,0.33; 7 -2.921,-0.33; 8 -2.921,-0.965; 9 -2.921,-1.626; 10 -2.921,-2.286; 11 -2.921,-2.921; 12 -2.921,-3.581; 13 2.921,-3.581; 14 2.921,-2.921; 15 2.921,-2.286; 16 2.921,-1.626; 17 2.921,-0.965; 18 2.921,-0.33; 19 2.921,0.33; 20 2.921,0.965; 21 2.921,1.626; 22 2.921,2.286; 23 2.921,2.921; 24 2.921,3.581
SO-16 = smd 0.8 x 1.2: 1 -4.445,-3.15; 2 -3.175,-3.15; 3 -1.905,-3.15; 4 -0.635,-3.15; 5 0.635,-3.15; 6 1.905,-3.15; 7 3.175,-3.15; 8 4.445,-3.15; 9 4.445,3.15; 10 3.175,3.15; 11 1.905,3.15; 12 0.635,3.15; 13 -0.635,3.15; 14 -1.905,3.15; 15 -3.175,3.15; 16 -4.445,3.15
CPC1002N = smd 0.6 x 1.3: 1 -1.27,-2.8; 2 1.27,-2.8; 3 1.27,2.8; 4 -1.27,2.8
MOLEX-1X2 = drill 1.016 pad 1.88 square: 1 0,0 | drill 1.016 pad 1.88: 2 2.54,0
1803426 = drill 1.2 pad 2: 1 -1.905,0.635; 2 1.905,0.635
JST-2-PTH = drill 0.7 pad 1.448: 1 -1,0; 2 1,0
SIP-100-04-40 = drill 1.016 pad 1.778 square: 1 -3.81,0 | drill 1.016 pad 1.778 octagon: 2 -1.27,0; 3 1.27,0; 4 3.81,0
HW4-2.0 = drill 0.8 pad 1.27 square: 1 -3,0 | drill 0.8 pad 1.27: 2 -1,0; 3 1,0; 4 3,0
2X08_SHROUD = drill 1.2 square: 1 -8.89,-1.27 | drill 1.2: 2 -8.89,1.27; 3 -6.35,-1.27; 4 -6.35,1.27; 5 -3.81,-1.27; 6 -3.81,1.27; 7 -1.27,-1.27; 8 -1.27,1.27; 9 1.27,-1.27; 10 1.27,1.27; 11 3.81,-1.27; 12 3.81,1.27; 13 6.35,-1.27; 14 6.35,1.27; 15 8.89,-1.27; 16 8.89,1.27
1803484 = drill 1.2 pad 2: 1 -13.335,0.635; 2 -9.525,0.635; 3 -5.715,0.635; 4 -1.905,0.635; 5 1.905,0.635; 6 5.715,0.635; 7 9.525,0.635; 8 13.335,0.635
RASPBERRYPI_BASTELSTUBE_V13_RASPI_BOARD_B+_FULL = drill 1 pad 1.778 square: 1 -24.13,-1.27 | drill 1 pad 1.778: 2 -24.13,1.27; 3 -21.59,-1.27; 4 -21.59,1.27; 5 -19.05,-1.27; 6 -19.05,1.27; 7 -16.51,-1.27; 8 -16.51,1.27; 9 -13.97,-1.27; 10 -13.97,1.27; 11 -11.43,-1.27; 12 -11.43,1.27; 13 -8.89,-1.27; 14 -8.89,1.27; 15 -6.35,-1.27; 16 -6.35,1.27; 17 -3.81,-1.27; 18 -3.81,1.27; 19 -1.27,-1.27; 20 -1.27,1.27; 21 1.27,-1.27; 22 1.27,1.27; 23 3.81,-1.27; 24 3.81,1.27; 25 6.35,-1.27; 26 6.35,1.27; 27 8.89,-1.27; 28 8.89,1.27; 29 11.43,-1.27; 30 11.43,1.27; 31 13.97,-1.27; 32 13.97,1.27; 33 16.51,-1.27; 34 16.51,1.27; 35 19.05,-1.27; 36 19.05,1.27; 37 21.59,-1.27; 38 21.59,1.27; 39 24.13,-1.27; 40 24.13,1.27 | hole 2.75: -29,-23; -29,0; 29,-23; 29,0
1.8TFT_CHI_2.0 = drill 1.016 pad 1.778 octagon: 1 -23.85,-18.85; 2 -23.85,-16.31; 3 -23.85,-13.77; 4 -23.85,-11.23; 5 -23.85,-8.69; 6 -23.85,-6.15; 7 -23.85,-3.61; 8 -23.85,-1.07; 9 -23.85,1.47; 10 -23.85,4.01; 11 -23.85,6.55; 12 -23.85,9.09; 13 -23.85,11.63; 14 -23.85,14.17; 15 -23.85,16.71; 16 -23.85,19.25 | hole 3.3: 19.9,20.2; -21.1,-19.8; -21.1,20.2
LED-0603 = smd 0.8 x 0.8: A 0,-0.75; C 0,0.75
LED5MM = drill 0.813 pad 1.88: A -1.27,0; K 1.27,0
SOT23 = smd 1 x 1.4: 1 -0.95,-1.1; 2 0.95,-1.1; 3 0,1.1
0603-RES = smd 0.6 x 0.9: 1 -0.75,0; 2 0.75,0
1206-RES = smd 0.9 x 1.6: 1 -1.45,0; 2 1.45,0
2512-RES = smd 1.6 x 3.5: 1 -2.7,0; 2 2.7,0
SOLDERJUMPER_10MIL = smd 1.1 x 1: 1 -0.762,0; 2 0.762,0 | smd 0.635 x 0.254: WIRE 0,0
ESWITCH320 = drill 1.22: 1 -3.81,3.81; 3 1.27,-1.27 | hole 1: -3.81,-3.81; 3.81,1.27
1206-RCW = smd 3.8 x 1.6: 1 0,0

### Placement (x,y rotation side)
C1  1.46,71.36 270 top
C2  4.06,28.7 90 top
C3  5.59,42.42 180 top
C4  6.42,71.39 270 top
C5  6.6,28.7 90 top
C6  9.08,71.36 180 top
C7  9.08,72.88 180 top
C8  9.65,42.42 0 top
C9  41.91,52.07 180 top
C10  42.67,47.5 270 top
C11  48.72,80.37 0 top
C12  48.77,78.49 0 top
C13  65.28,42.16 180 top
C14  65.28,43.94 180 top
C15  68.33,72.39 0 top
C16  68.33,74.17 0 top
C17  14.73,80.01 180 top
C18  82.04,78.74 270 top
C19  83.82,15.24 270 top
C20  68.58,25.65 90 top
D1  58.93,74.17 90 top
D2  64.01,74.68 90 top
D3  90.17,64.26 0 top
D4  90.93,22.35 0 top
D5  90.93,26.67 0 top
D6  90.93,30.48 0 top
D7  90.93,34.29 0 top
D8  90.93,72.39 180 top
D9  90.93,76.45 180 top
D10  91.44,68.33 180 top
FB1  3.12,71.39 90 top
FB2  4.76,71.36 90 top
FB3  48.01,75.69 270 top
FB4  66.55,79.5 270 top
FID1  1.78,67.06 0 top
FID2  114.55,38.86 0 top
FID3  2.54,10.67 0 top
IC1  5.33,25.65 90 top
IC2  7.37,47.24 270 top
IC3  9.33,67.8 180 top
IC4  45.21,50.04 0 top
IC5  69.34,48.74 180 top
IC6  98.04,30.73 90 top
IC7  110.49,66.04 270 top
IC8  110.49,70.87 270 top
IC9  110.49,75.69 270 top
IC10  110.49,80.52 270 top
J1  3.56,80.01 0 top
J2  9.91,13.46 0 top
J3  10.67,27.94 270 top
J4  56.9,80.26 0 top
J5  93.98,42.42 0 top
J6  93.98,58.42 180 top
J7  101.09,50.42 180 top
J8  107.19,42.42 0 top
J9  107.19,58.42 180 top
J10  120.9,25.91 90 top
J11  120.9,66.55 90 top
J100  40.64,58.93 0 bottom
LCD100  50.8,46.23 270 bottom
LED1  2.54,59.69 0 top
LED2  4.32,59.69 0 top
LED3  6.1,59.69 0 top
LED4  6.6,22.35 0 top
LED100  72.39,17.65 0 bottom
LED101  72.39,74.8 0 bottom
Q1  35.31,77.22 90 top
R1  2.54,56.9 90 top
R2  3.81,22.35 90 top
R3  4.32,56.9 90 top
R4  4.57,50.55 0 top
R5  5.84,19.81 0 top
R6  5.84,52.32 0 top
R7  6.1,56.9 90 top
R8  10.67,48.77 180 top
R9  11.62,72.12 90 top
R10  12.77,67.33 270 top
R11  12.89,72.12 90 top
R12  19.81,54.61 0 top
R13  26.67,64.01 270 top
R14  34.04,73.41 270 top
R15  38.1,77.22 270 top
R16  44.45,53.85 270 top
R17  45.21,46.74 180 top
R18  52.83,52.58 0 top
R19  54.36,74.17 0 top
R20  56.39,52.58 180 top
R21  56.64,74.93 90 top
R22  60.96,48.01 90 top
R23  60.96,51.31 270 top
R24  61.47,75.44 90 top
R25  62.74,50.8 90 top
R26  63.25,47.5 0 top
R27  64.01,50.8 90 top
R28  74.42,44.96 90 top
R29  76.19,73.99 270 top
R30  76.61,17.62 0 top
R31  80.62,66.47 90 top
R32  80.77,36.15 270 top
R33  81.2,23.67 0 top
R34  81.46,53.29 0 top
R35  87.38,33.53 90 top
R36  87.38,36.83 270 top
R37  87.63,41.15 90 top
R38  88.14,24.13 90 top
R39  88.14,27.43 270 top
R40  90.94,37.61 90 top
R41  97.28,62.74 270 top
R42  99.31,62.74 270 top
R43  100.18,38.26 0 top
R44  101.09,62.74 270 top
R45  103.38,62.74 270 top
R46  103.98,37.65 90 top
R47  104.65,65.28 180 top
R48  104.65,70.1 180 top
R49  104.65,74.93 180 top
R50  104.65,79.76 180 top
R51  111.76,11.81 180 top
R52  111.76,15.11 0 top
R53  111.76,18.41 180 top
R54  111.76,21.72 0 top
R55  111.76,25.02 180 top
R56  111.76,28.32 0 top
R57  111.76,32.16 180 top
R58  111.76,35.43 0 top
SJ1  33.1,63.73 180 top
SJ2  46.77,67.69 270 top
SJ3  49.31,67.65 270 top
SJ4  51.85,67.55 270 top
SJ5  54.39,67.59 270 top
SJ6  56.9,67.56 270 top
SW100  81.92,27.18 0 bottom
SW101  81.92,39.88 0 bottom
SW102  81.92,52.58 0 bottom
SW103  81.92,65.28 0 bottom
TP1  27.18,18.03 90 top
TP2  32.26,18.03 90 top
TP3  37.34,18.03 90 top
TP4  42.42,18.03 90 top
TP5  47.5,18.03 90 top
TP6  73.15,81.28 90 top

### Tracks (layer width: path | path; a pad name or v marks a point on that pad's centre or on a via)
3V3
  Top 0.61: R16.1 J100.17
  Bottom 0.61: J100.17 44.45,56.13 45.21,55.37 63.75,55.37 64.77,56.39 J100.1 65.02,57.66
5V_RFID_TX
  Top 0.305: R21.2 56.64,76.71 58.17,78.23 J4.3
!BUTTON0
  Top 0.305: R31.1 80.64,65.69 SW103.3 80.64,62.36 71.37,53.09 70.61,53.09 69.85,52.32 IC5.13
!BUTTON1  (via drill 0.3)
  Top 0.305: IC5.14 70.61,51.66 v70.67,51.73 | R34.1 80.64,53.23 SW102.3
  Bottom 0.305: v70.67,51.73 80.22,51.73 SW102.3
!BUTTON2  (via drill 0.3)
  Top 0.305: IC5.15 69.88,51.03 v70.1,50.8 | R32.1 80.77,38.48 SW101.3
  Bottom 0.305: v70.1,50.8 78.74,50.8 81.79,47.75 81.79,39.62 80.77,38.61 SW101.3
!BUTTON3  (via drill 0.3)
  Top 0.305: v80.6,33.31 80.6,25.95 | 80.6,25.95 SW100.3 | IC5.16 69.01,50.37 v69.34,50.04 | 80.6,25.95 80.6,23.81 R33.1
  Bottom 0.305: v69.34,50.04 78.49,50.04 81.03,47.5 81.03,41.4 78.99,39.37 78.99,34.92 v80.6,33.31
!I/O_IRQ  (via drill 0.3)
  Top 0.305: IC5.1 71.32,45.16 70.36,44.2 v70.36,42.67 | J100.11 R18.1 v52.08,51.31
  Bottom 0.305: v70.36,42.67 69.6,41.91 61.72,41.91 52.32,51.31 v52.08,51.31
!I/O_RESET  (via drill 0.3)
  Top 0.305: IC5.3 70.84,46.46 69.34,44.96 v69.34,43.69 | J100.7 R20.1 57.15,52.57 v57.15,51.31
  Bottom 0.305: v69.34,43.69 68.33,42.67 62.23,42.67 57.15,47.75 v57.15,51.31
!PWR_LOSS
  Top 0.305: J100.37 19.05,54.62 R12.1 10.16,54.61 8.33,52.78 IC2.1
+3.3V  (via drill 0.3, 0.4, 0.6)
  Top 0.305: R27.2 63.4,51.55 R25.2 | v81.79,67.06 81.62,67.22 R31.2 | R39.2 v88.14,25.65 | R35.2 v87.38,35.05 R36.2 | R34.2 82.86,53.29 v83.06,53.09 | R18.2 v54.61,52.58 R20.2 | IC5.24 66.24,45.16 66.04,44.96 66.04,43.98 C14.1 | 20.57,54.62 R12.2 | D1.2 59.93,75.93 v59.94,75.95 | D2.2 67.12,75.63 67.43,75.32 C16.1
  Top 0.406: v82.04,35.31 81.95,35.4 R32.2 | R33.2 82.85,23.67 v83.06,23.88 83.06,22.86 77.82,17.62 R30.2 | R38.2 v88.14,25.65 | R7.1 6.1,55.37 v6.35,55.12 | v20.57,55.63 20.57,54.62 | R29.2 76.19,72.15 76.2,72.14 | TP4.1 42.42,39.12 48.01,44.7 v48.01,54.1
  Top 0.61: IC4.5 44.26,52.39 44.45,52.58 | 44.45,52.58 R16.2 | 44.45,52.58 44.7,52.83 45.72,52.83 46.99,54.1 v48.01,54.1 | v75.18,72.14 76.2,72.14 78.49,72.14 81.79,68.83 v81.79,67.06 | R22.2 v60.96,49.68 R23.2 | 63.4,51.55 63.4,52.48 v63.75,52.83 | 66.18,43.84 C13.1 66.18,33.39 68.58,30.99 C20.+ | 66.18,43.84 C14.1 | 66.18,43.84 66.96,43.84 v67.06,43.94 | R13.1 26.67,70.1 31.5,74.93 31.5,76.96 33.02,78.49 35.56,78.49 35.88,78.17 Q1.2 36.61,77.97 R15.1 38.11,77.98 40.13,77.98 45.97,72.14 48.01,72.14 | R12.2 20.56,53.35 23.62,50.29 41.91,50.29 42.71,51.09 C9.1 | v49.53,72.14 48.01,72.14 | FB3.2 48.01,72.14 | LCD100.2 67.11,71.97 C15.1 67.53,74.07 C16.1
  Top 0.813: C9.1 43.94,52.07 44.26,52.39
  Bottom 0.305: 87.88,35.05 88.01,35.18 88.14,35.05 | v83.06,53.09 83.82,53.09 83.95,53.21 | v82.04,35.31 82.3,35.31 | 60.96,53.85 61.21,54.1 | v54.61,52.58 54.61,54.1 | v59.94,75.95 59.94,72.14 | 64.77,72.39 64.52,72.14
  Bottom 0.406: 90.93,46.23 89.66,44.96 89.66,36.83 88.01,35.18 | 87.88,35.05 v87.38,35.05 86.87,34.54 83.06,34.54 82.3,35.31 | 88.14,35.05 v88.14,25.65 84.84,25.65 v83.06,23.88 | v6.35,55.12 20.07,55.12 v20.57,55.63
  Bottom 0.61: J7.8 102.36,47.5 101.09,46.23 90.93,46.23 83.95,53.21 82.55,54.61 | v81.79,67.06 82.8,66.04 82.8,54.86 82.55,54.61 | 82.55,54.61 81.03,54.61 79.5,56.13 76.71,56.13 75.18,54.61 69.09,54.61 68.58,54.1 64.01,54.1 | v48.01,54.1 54.61,54.1 61.21,54.1 64.01,54.1 | 60.96,53.85 v60.96,49.68 60.96,45.72 62.74,43.94 v67.06,43.94 | v49.53,72.14 59.94,72.14 64.52,72.14 66.29,72.14 67.11,71.32 LCD100.2 67.11,71.17 68.07,72.14 v75.18,72.14 | v63.75,52.83 63.75,53.85 64.01,54.1
+5VB  (via drill 0.3, 0.4, 0.6)
  Top 0.305: D8.2 89.17,73.39 v89.15,73.41 | D10.2 89.68,69.33 v89.66,69.34 | D5.2 91.88,24.85 v91.9,24.83 | v91.9,20.42 91.9,21.33 D4.2 | D6.2 91.88,28.65 v91.9,28.63 | D7.2 91.88,32.45 v91.9,32.43 | v89.15,77.47 89.97,77.47 D9.2 | v92.2,63.25 91.14,63.25 D3.2 | R3.1 4.32,55.12 5.33,54.1 7.37,54.1 v7.68,53.87 7.7,53.86 7.7,53.85 | 66.32,78.42 FB4.2 | 67.63,77.66 v67.82,77.47 | v96.01,47.5 96.01,39.37 94.74,38.1 v92.96,38.1 | IC2.7 v7.7,46.15 | 7.62,54.28 7.7,54.36
  Top 0.406: R17.2 44.45,47.24 44.26,47.43 IC4.1 43.91,48.74 43.47,48.3 C10.1 | 9.91,72.91 C7.1 | 11.6,72.88 R9.2 | TP3.1 37.34,45.72 37.6,45.99
  Top 0.61: 11.6,72.88 C7.1 | J100.4 J100.2 | 7.7,53.85 7.7,54.36 7.7,62.31 v7.87,62.48 | 9.91,72.91 v9.91,74.42 9.91,78.74 11.18,80.01 C17.+ | 37.6,45.99 37.72,46.1 | 37.72,46.1 39.92,48.3 C10.1 | R9.2 R11.2 | FB4.2 66.55,77.98 67.06,77.47 v67.82,77.47 | C18.+ v82.04,73.41 | v7.7,46.15 37.67,46.15 37.72,46.1
  Bottom 0.305: v91.9,20.42 v91.9,24.83 v91.9,28.63 v91.9,32.43 91.95,32.48 91.95,37.59 92.46,38.1 v92.96,38.1 | v89.15,77.47 v89.15,73.41 89.66,72.9 v89.66,69.34 92.98,66.02 92.98,64.02 v92.2,63.25 91.97,63.02 91.97,54.84 92.71,54.1 95.25,54.1 96.01,53.34 v96.01,47.5 | 7.7,53.86 v7.68,53.87
  Bottom 0.61: v9.91,74.42 7.87,72.39 v7.87,62.48 8.03,62.64 61.72,62.64 62.23,62.13 J100.4 J100.2 69.34,64.77 73.15,64.77 77.09,68.71 | 77.09,68.71 81.79,73.41 v82.04,73.41 v89.15,73.41 | 77.09,68.71 77.09,75.56 75.18,77.47 v67.82,77.47 | v7.7,46.15 7.7,53.86
  pour Top (no thermals): 8.38,68.88 8.38,69.85 8.64,70.1 8.89,70.1 9.4,70.61 9.4,73.41 10.67,73.41 10.67,70.61 10.03,70.61 9.22,69.8 9.22,68.88
+5VIN  (via drill 0.3, 0.6, 0.8)
  Top 0.305: R1.1 2.54,38.1 3.05,37.59 v3.05,37.34 | R5.1 v4.32,19.81
  Top 0.406: IC2.6 7.04,43.07 C3.1 | TP1.1 27.18,14.99 26.42,14.22 11.94,14.22 J2.2
  Top 0.61: C2.1 4.06,26.63 IC1.4 | C19.+ v83.82,10.41
  Top 0.813: C3.1 6.35,42.38 6.35,40.64 v3.05,37.34 | v1.52,27.94 4.03,27.94 C2.1
  Bottom 0.305: v4.32,19.81 2.54,19.81
  Bottom 0.813: J7.4 107.44,46.23 | 107.44,46.23 107.44,44.7 | J8.3 108.19,43.96 107.44,44.7 | 107.44,44.7 96.01,44.7 94.98,43.67 J5.3 94.98,37.58 94.23,36.83 94.23,22.86 93.73,22.35 93.73,18.54 85.6,10.41 v83.82,10.41 42.42,10.41 | J6.3 92.98,57.64 94.23,56.39 106.17,56.39 | 106.17,56.39 111,56.39 112.27,55.12 112.27,47.24 111.25,46.23 107.44,46.23 | J9.3 106.17,58.4 106.17,56.39 | 42.42,10.41 11.68,10.41 | 11.68,10.41 6.86,10.41 2.54,14.73 2.54,19.81 2.54,27.94 | 42.29,10.54 42.42,10.41 | 2.54,27.94 2.54,36.83 v3.05,37.34 | v1.52,27.94 2.54,27.94 | J2.2 11.81,10.54 11.68,10.41
CHARGE_STATUS  (via drill 0.3)
  Top 0.305: LED4.C 6.63,23.13 IC1.1 12.51,24.7 24.38,36.58 v24.38,43.43 | J100.32 25.4,58.93 25.4,55.37 24.38,54.36 v24.38,52.07
  Top 0.406: J100.32 R13.2
  Bottom 0.305: v24.38,43.43 v24.38,52.07
GND  (via drill 0.3, 0.4)
  Top 0.305: v9.33,67.55 IC3.11 6.87,67.55 6.86,67.56 | v9.33,67.55 IC3.THERMAL 9.58,68.05 IC3.3 11.48,68.05 | IC3.15 9.58,67.3 v9.33,67.55
  Top 0.61: 69.6,70.13 LCD100.1 69.65,71.87 C15.2 69.13,74.07 C16.2
  Bottom 0.305: v9.33,67.55 9.4,67.55 9.4,67.82
  other vias: 6.6,30.73 4.83,21.59 42.67,45.47 45.21,50.04 72.9,53.34 96.52,35.05 96.44,33.15 96.44,30.1 96.44,27.56 89.66,34.54 89.66,30.73 89.66,26.92 88.39,72.39
  pour Top (rank 2): 2.54,84.33 arc90 0,81.79 0,10.67 arc90 2.54,8.13 124.46,8.13 arc90 127,10.67 127,81.79 arc90 124.46,84.33
  pour Bottom (rank 2): 0,81.79 0,10.67 arc90 2.54,8.13 124.46,8.13 arc90 127,10.67 127,81.79 arc90 124.46,84.33 2.54,84.33 arc90
I2C_SCL  (via drill 0.3)
  Top 0.305: J100.5 59.69,47.75 60.2,47.24 60.95,47.24 R22.1 60.96,46.99 61.49,46.46 IC5.22 67.79,46.46 v69.6,48.26 | v78.74,48.26 81.03,48.26 84.45,51.69 J7.15
  Bottom 0.305: v69.6,48.26 v78.74,48.26
I2C_SDA  (via drill 0.3)
  Top 0.305: J100.3 v62.23,53.09 61.47,53.09 60.96,52.58 R23.1 | v64.52,45.47 64.87,45.82 IC5.23 68.68,45.82 v69.6,46.74 | v80.01,46.74 81.28,46.74 84.96,50.42 93.85,50.42 94.74,51.31 J7.13
  Bottom 0.305: v62.23,53.09 62.23,46.48 63.25,45.47 v64.52,45.47 | v69.6,46.74 v80.01,46.74
I2S_BCK  (via drill 0.3)
  Top 0.305: IC3.16 10.08,65.61 v14.22,61.47
  Bottom 0.305: J100.12 52.07,59.94 51.05,58.93 15.75,58.93 14.22,60.45 v14.22,61.47
I2S_DOUT
  Top 0.305: IC3.1 10.83,66.64 16.51,60.96 J100.40
I2S_WS/LRCLK
  Top 0.305: J100.35 20.32,58.93 15.75,58.93 9.08,65.6 IC3.14
IN0  (via drill 0.3)
  Top 0.305: IC5.4 74.8,47.12 v83.06,38.86 83.06,28.19 87.88,23.37 88.13,23.37 R38.1 90.9,23.38 D4.3 90.95,23.37 93.47,23.37 94.89,24.79 IC6.16 | R37.1 87.63,39.56 v87.6,39.53
  Bottom 0.305: v87.6,39.53 86.93,38.86 v83.06,38.86
IN0P
  Top 0.305: R37.2 88.15,42.42 J5.1 91,42.44 91,44.23 92.2,45.43 J7.16
IN1  (via drill 0.3)
  Top 0.305: IC5.5 75.67,47.78 84.07,39.37 84.07,38.35 83.82,38.1 v83.82,37.74 83.82,30.48 86.11,28.19 88.15,28.19 | IC6.14 93.85,28.83 92.71,27.69 90.95,27.69 | 90.95,27.69 D5.3 | 90.95,27.69 89.92,27.69 89.41,28.19 88.15,28.19 | 88.15,28.19 R39.1 | 89.12,37.63 v88.9,37.85 89.88,36.86 R40.1
  Bottom 0.305: v83.82,37.74 87.01,37.74 87.12,37.85 v88.9,37.85
IN1P
  Top 0.305: R40.2 90.94,39.47 92.98,41.51 J5.2 93,42.44 93,44.13 94.74,45.87 J7.14
IN2  (via drill 0.3)
  Top 0.305: IC5.6 76.05,48.41 85.09,39.37 85.09,37.34 84.58,36.83 84.58,34.54 86.35,32.78 R35.1 88.67,31.48 D6.3 91.04,31.37 IC6.12 96.04,31.37 v96.1,31.43 | R43.1 98.73,38.26 v98.6,38.23
  Bottom 0.305: v98.6,38.23 98.6,33.93 v96.1,31.43
IN2P
  Top 0.305: J7.12 97.28,47.35 100.9,43.73 103.9,43.73 104.19,43.44 J8.1 104.19,40.92 101.6,38.33 101,38.33 R43.2
IN3
  Top 0.305: IC5.7 76.4,49.07 86.36,39.12 86.36,38.35 87.13,37.58 R36.1 87.9,37.58 90.19,35.29 D7.3 92.47,35.29 | 92.47,35.29 93.85,33.91 IC6.10 | R46.1 94.09,36.9 92.47,35.29
IN3P
  Top 0.305: R46.2 104,38.43 104,39.03 106.19,41.22 J8.2 106.19,43.34 104.8,44.73 102.4,44.73 99.82,47.31 J7.10
LCD_BACKLIGHT
  Top 0.305: J100.29 29.46,57.66 30.48,58.67 30.48,62.99 31.24,63.75 32.31,63.75 SJ1.2
LCD_CS
  Top 0.305: SJ2.2 46.77,65.56 45.97,64.77 39.88,64.77 36.83,61.72 J100.24
LCD_D/C
  Top 0.305: SJ5.2 54.39,65.31 51.56,62.48 46.74,62.48 J100.18
LCD_MOSI
  Top 0.305: SJ4.2 51.85,64.04 51.05,63.25 42.16,63.25 40.64,61.72 40.64,58.93 J100.19
LCD_RESET
  Top 0.305: SJ6.2 56.9,65.79 52.83,61.72 47.5,61.72 46.99,61.21 J100.16
LCD_SCK
  Top 0.305: 49.31,66.58 SJ3.2 49.28,66.86 49.28,65.79 47.5,64.01 40.39,64.01 38.1,61.72 38.1,58.93 J100.23
LED0
  Top 0.305: IC5.17 65.35,49.71 65.02,50.04 65.02,52.83 66.55,54.36 71.63,54.36 73.03,55.75
  Top 0.406: LED101.K 71.12,72.39 73.15,70.36 73.15,55.88 73.03,55.75
LED1  (via drill 0.4)
  Top 0.406: IC5.18 67.87,49.07 v68.07,49.28 | v73.66,40.64 73.66,20.19 LED100.K
  Bottom 0.406: v68.07,49.28 68.07,46.23 v73.66,40.64
N$1
  Top 0.305: IC3.2 11.67,67.55 12.19,68.07 R10.1 12.77,70.17 12.89,70.29 R11.1
N$2
  Top 0.305: IC3.9 5.36,68.55 4.76,69.16 FB2.1
N$3
  Top 0.61: R14.1 34.04,77.05 Q1.3
N$4
  Top 0.305: FB1.1 3.12,68.77 3.83,68.05 IC3.10
N$5
  Top 0.305: R9.1 11.62,68.77 11.4,68.55 IC3.4
N$6
  Top 0.61: C1.1 1.54,72.24 FB1.2 3.12,79.57 J1.1
N$7
  Top 0.61: C4.1 4.77,72.19 FB2.2 4.76,77.4 6.1,78.74 J1.2
N$8
  Top 0.305: IC5.20 65.25,47.78 64.77,48.26 63.5,48.26 62.74,49.02 R25.1
N$9
  Top 0.61: LCD100.15 34.09,71.9 R14.2
N$10
  Top 0.305: J4.4 60.71,78.99 61.47,78.23 R24.2
N$11
  Top 0.305: R7.2 LED3.A
N$12
  Top 0.305: R3.2 LED2.A
N$13
  Top 0.305: IC5.19 65.38,48.41 64.01,49.78 R27.1
N$14
  Top 0.305: IC1.5 3.82,24.49
  Top 0.406: 3.82,24.49 3.82,23.11 R2.2
N$15
  Top 0.61: R52.1 108.08,15.11 104.65,18.54 104.65,24.89 101.98,27.56 IC6.2
N$16
  cutout Top: 110.49,84.33 110.49,60.71 113.79,57.4 113.79,42.16 107.7,36.07 100.58,36.07 99.31,34.8 99.31,8.13 124.46,8.13 arc90 127,10.67 127,81.79 arc90 124.46,84.33
  cutout Bottom: 110.49,84.33 110.49,60.71 113.79,57.4 113.79,42.16 107.7,36.07 100.58,36.07 99.31,34.8 99.31,8.13 124.46,8.13 arc90 127,10.67 127,81.79 arc90 124.46,84.33
N$17
  Top 0.305: LED4.A 6.6,19.82 R5.2
N$18
  Top 0.406: IC4.3 46.16,47.43 45.97,47.24 45.97,46.75 R17.1
N$19
  Top 0.61: IC6.1 101.19,25.04 103.38,22.86 103.38,18.03 108.71,12.7 108.71,12.16 R51.2
N$20
  Top 0.61: R58.1 108.08,35.43 107.82,35.18 IC6.8
N$21
  Top 0.305: IC5.21 64.9,47.12 64.52,47.5 R26.2
N$22
  Top 0.305: IC5.2 74.41,45.82 R28.2
N$23
  Top 0.61: IC6.7 106.05,33.91 107.8,32.16 R57.2
N$24
  Top 0.61: IC6.6 104.27,32.64 108.58,28.32 R56.1
N$25
  Top 0.61: IC6.5 103.5,31.37 108.71,26.16 108.71,25.37 R55.2
N$26
  Top 0.305: R6.2 7.04,51.88 IC2.3
N$27
  Top 0.305: LCD100.6 56.95,68.38 SJ6.1
N$28
  Top 0.305: LCD100.7 54.39,70.08 SJ5.1
N$29
  Top 0.305: SJ2.1 46.79,68.46 LCD100.10
N$30
  Top 0.305: SJ4.1 51.87,68.31 LCD100.8
N$31
  Top 0.305: SJ3.1 49.33,68.41 LCD100.9
N$32
  Top 0.61: IC7.3 113.28,60.71 115.32,58.67 115.32,56.9 119,53.21 J11.1
N$33
  Top 0.305: SJ1.1 34.77,63.73 35.37,64.33 35.37,70.93 36.41,71.97 Q1.1
  Top 0.61: R15.2 36.61,76.47 Q1.1
N$36
  Top 0.61: IC6.4 103,30.1 107.19,25.91 107.19,22.61 108.08,21.72 R54.1
N$37
  Top 0.305: IC2.4 6.4,50.49 6.35,50.55 R4.2
N$39
  Top 0.61: IC6.3 102.49,28.83 105.92,25.4 105.92,21.84 108.71,19.05 108.71,18.76 R53.2
N$40
  Top 0.61: R54.2 117.98,21.72 J10.4
N$41
  Top 0.61: R53.1 118.49,18.41 J10.3
N$42
  Top 0.61: R52.2 119,15.11 J10.2
N$43
  Top 0.61: R51.1 119.51,11.81 J10.1
N$44
  Top 0.61: R55.1 117.47,25.02 J10.5
N$45
  Top 0.61: R56.2 116.97,28.32 J10.6
N$46
  Top 0.61: R57.1 116.99,32.16 J10.7
N$47
  Top 0.61: R58.2 116.46,35.43 J10.8
N$48
  Top 0.406: LED101.A 76.12,74.8 R29.1
N$49
  Top 0.406: R30.1 73.69,17.62 LED100.A
N$50
  Top 0.305: R1.2 LED1.A
N$51
  Top 0.61: 55.63,82.3 56.13,82.8 63.5,82.8 65.95,80.35 FB4.1 | 55.63,82.3 J4.2 | 55.63,82.3 55.12,82.8 49.53,82.8 47.92,81.19 C11.1 47.87,80.32 C12.1 48.01,78.35 FB3.1
N$58
  Top 0.305: IC7.1 107.43,67.31 R47.1
N$59
  Top 0.61: J11.2 118.75,57.02 114.81,60.96 114.81,66.55 114.05,67.31 IC7.4
N$60
  Top 0.61: J11.7 117.47,76.07 114.3,79.25 IC10.3
N$61
  Top 0.305: IC8.1 107.43,72.14 R48.1
N$62
  Top 0.61: J11.8 116.2,79.88 114.3,81.79 IC10.4
N$63
  Top 0.61: IC9.3 114.3,74.42 J11.5
N$64
  Top 0.61: J11.6 119,72.26 114.3,76.96 IC9.4
N$65
  Top 0.61: J11.3 116.08,65.02 116.08,67.56 114.05,69.6 IC8.3
N$66
  Top 0.61: J11.4 117.35,67.56 117.35,69.09 114.3,72.14 IC8.4
N$68
  Top 0.305: IC9.1 107.43,76.96 R49.1
N$69
  Top 0.305: IC10.1 107.43,81.79 R50.1
OUT0
  Top 0.305: IC5.8 74.35,49.71 76.2,51.56 76.2,53.85 87.63,65.28 90.15,65.28 D3.3 103.38,65.26 | 103.38,65.26 103.88,65.26 R47.2 | R45.1 103.38,65.26
OUT0P
  Top 0.305: R45.2 107.74,61.99 110.2,59.53 110.2,58.43 J9.1 110.19,51.9 J7.1
OUT1  (via drill 0.3)
  Top 0.305: IC5.9 73.99,50.37 75.44,51.82 75.44,54.1 88.65,67.31 91.44,67.31 | 91.44,67.31 v100.33,67.31 103.12,70.1 R48.2 | D10.3 91.44,67.31 | R44.1 v101.09,64.26
  Bottom 0.305: v101.09,64.26 101.09,66.55 v100.33,67.31
OUT1P
  Top 0.305: R44.2 101.09,61.21 101.6,60.71 107.12,60.71 108.2,59.63 108.2,58.43 J9.2 108.19,54.02 107.5,53.33 107.5,51.75 J7.3
OUT2  (via drill 0.3)
  Top 0.305: IC5.10 73.64,51.03 74.68,52.07 74.68,54.36 88.14,67.82 88.14,69.09 90.44,71.39 D8.3 92.47,71.39 | R49.2 102.87,74.93 101.85,75.95 95.5,75.95 93.22,73.66 93.22,72.14 92.47,71.39 | v92.46,71.37 92.47,71.39 | R42.1 v99.31,64.26
  Bottom 0.305: v92.46,71.37 92.46,70.87 99.06,64.26 v99.31,64.26
OUT2P
  Top 0.305: R42.2 99.31,60.75 J6.1 97,58.4 97,57.13 97.8,56.33 104,56.33 104.9,55.43 J7.5
OUT3  (via drill 0.3)
  Top 0.305: IC5.11 73.25,51.66 73.91,52.32 73.91,54.61 87.38,68.07 87.38,73.15 89.66,75.44 90.92,75.44 D9.3 | R50.2 97.28,79.76 92.98,75.45 D9.3 | R41.1 v97.28,64.26 | v90.93,74.42 D9.3
  Bottom 0.305: v90.93,74.42 91.19,74.17 91.19,70.36 v97.28,64.26
OUT3P
  Top 0.305: R41.2 97.16,61.99 95,59.83 95,58.44 | 95,58.44 J6.2 | 95,58.44 95,57.43 97.1,55.33 101,55.33 102.4,53.93 102.4,51.73 J7.7
RFID_RX  (via drill 0.3)
  Top 0.305: J7.11 97.28,52.83 96.52,53.59 84.84,53.59 v81.79,56.64 | 61.73,74.68 R24.1 | R24.1 61.72,74.68 | R24.1 61.47,73.15 60.76,72.44 60.76,67.11 57.15,63.5 J100.8 58.67,61.72 v70.61,61.72 | D2.3 63,74.69 R24.1
  Bottom 0.305: v81.79,56.64 76.71,61.72 v70.61,61.72
RFID_TX  (via drill 0.3)
  Top 0.305: J7.9 99.82,53.34 98.55,54.61 85.09,54.61 v81.79,57.91 | J100.10 54.61,62.23 58.22,65.84 58.22,73.36 57.93,73.64 D1.3 57.91,74.18 R21.1 R19.2
  Bottom 0.305: v81.79,57.91 77.22,62.48 69.6,62.48 66.04,58.93 55.88,58.93 J100.10
SHUTDOWN  (via drill 0.3)
  Top 0.305: J100.13 48.26,58.93 43.69,58.93 43.18,58.42 43.18,56.39 v41.4,54.61 | IC2.2 7.7,49.2 8.13,48.77 R8.2 9.92,52.84 v10.41,53.34
  Bottom 0.305: v41.4,54.61 40.13,53.34 v10.41,53.34
V_BATT  (via drill 0.4)
  Top 0.406: IC2.8 8.33,42.94 C8.1 | v17.02,13.21 30.99,13.21 32.26,14.48 TP2.1
  Top 0.61: C5.1 6.63,27.87 6.63,27.18 IC1.3
  Top 0.813: C8.1 8.89,42.38 8.89,27.45 9.4,26.94 | J3.2 9.4,26.94 | 9.4,26.94 6.87,26.94 6.63,27.18
  Bottom 0.406: J3.2 10.67,19.56 v17.02,13.21
(copper drawn outside any net)
  shapes: Bottom circle x5, Top area x2944

### Text on the board
tPlace: - | + | RFID | GND | - + | SPEAKER | - + | - + | +5VIN | +5VB | +3.3 | OUT23 | OUT01 | DRY OUTPUTS: 60V 0.7A MAX | - + | IN01 | IN23 | 1S LIPO | CHARGING | INPUTS: 5-24V AC/DC | + | BATT | GND | +5VIN | +5VB | +3.3V | A. Shrey | Ver 2.0 | https://github.com/makeitlabs/ratt/ | 12/12/2018 | +5V POWER IN
tNames: DNP R16 if IC4